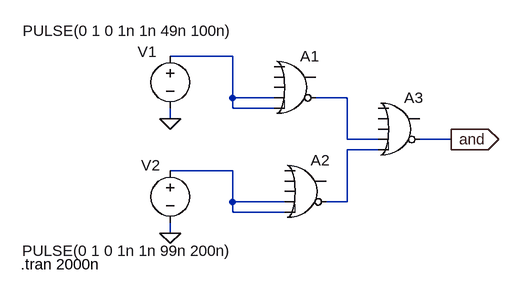
[diagram p0: schematic and_using_NOR.asc]
and_using_NOR.asc, the LTspice schematic file:
Version 4
SHEET 1 880 680
WIRE 112 48 16 48
WIRE 112 112 112 48
WIRE 176 112 112 112
WIRE 288 112 240 112
WIRE 112 128 112 112
WIRE 176 128 112 128
WIRE 16 144 16 128
WIRE 288 176 288 112
WIRE 336 176 288 176
WIRE 448 176 400 176
WIRE 336 192 288 192
WIRE 112 224 16 224
WIRE 112 272 112 224
WIRE 192 272 112 272
WIRE 288 272 288 192
WIRE 288 272 256 272
WIRE 112 288 112 272
WIRE 192 288 112 288
WIRE 16 320 16 304
FLAG 16 144 0
FLAG 16 320 0
FLAG 448 176 and
IOPIN 448 176 Out
SYMBOL voltage 16 32 R0
WINDOW 0 -50 9 Left 2
WINDOW 3 -227 -23 Left 2
WINDOW 123 0 0 Left 0
WINDOW 39 0 0 Left 0
SYMATTR InstName V1
SYMATTR Value PULSE(0 1 0 1n 1n 49n 100n)
SYMBOL voltage 16 208 R0
WINDOW 0 -45 8 Left 2
WINDOW 3 -228 139 Left 2
WINDOW 123 0 0 Left 0
WINDOW 39 0 0 Left 0
SYMATTR InstName V2
SYMATTR Value PULSE(0 1 0 1n 1n 99n 200n)
SYMBOL Digital\\or 208 32 R0
SYMATTR InstName A1
SYMBOL Digital\\or 224 192 R0
SYMATTR InstName A2
SYMBOL Digital\\or 368 96 R0
SYMATTR InstName A3
TEXT -214 368 Left 2 !.tran 2000n

The netlist it stands for:
* and_using_NOR.asc
V1 N001 0 PULSE(0 1 0 1n 1n 49n 100n)
V2 N004 0 PULSE(0 1 0 1n 1n 99n 200n)
A1 0 0 0 N001 N001 N002 0 0 OR
A2 0 0 0 N004 N004 N003 0 0 OR
A3 0 0 0 N002 N003 and 0 0 OR
.tran 2000n
.backanno
.end